# EAGLE schematic Hera v1 (EAGLE 7.4.0)
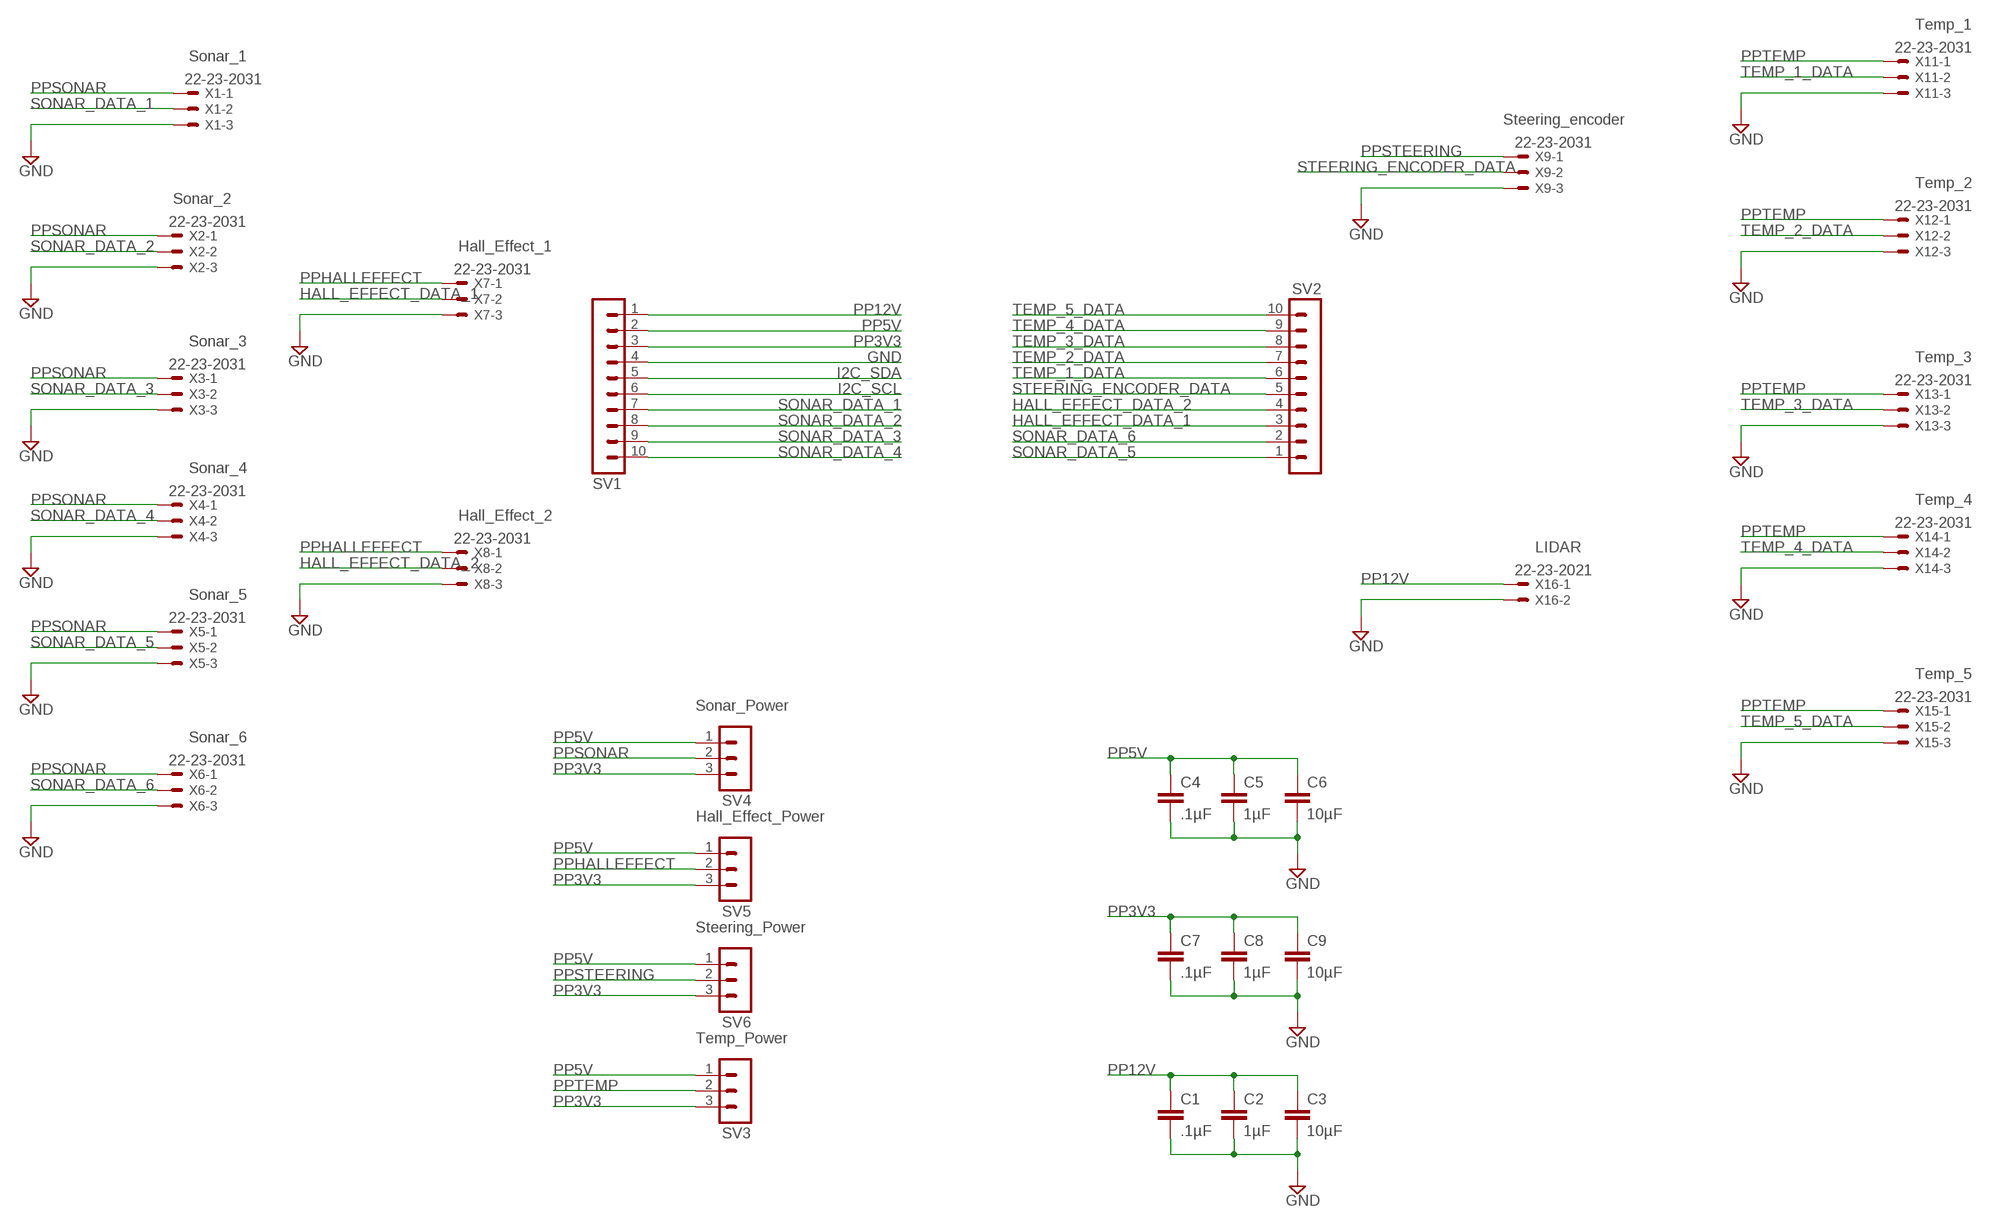
[diagram p0: schematic, sheet 1]

## Parts
C1  .1µF  C-EUC0402  [C0402]
C2  1µF  C-EUC0603  [C0603]
C3  10µF  C-EUC1206  [C1206]
C4  .1µF  C-EUC0402  [C0402]
C5  1µF  C-EUC0603  [C0603]
C6  10µF  C-EUC1206  [C1206]
C7  .1µF  C-EUC0402  [C0402]
C8  1µF  C-EUC0603  [C0603]
C9  10µF  C-EUC1206  [C1206]
SV1  MA10-1  [MA10-1]
SV2  MA10-1  [MA10-1]
SV3  MA03-1  [MA03-1]
SV4  MA03-1  [MA03-1]
SV5  MA03-1  [MA03-1]
SV6  MA03-1  [MA03-1]
X1  22-23-2031  [22-23-2031]
X2  22-23-2031  [22-23-2031]
X3  22-23-2031  [22-23-2031]
X4  22-23-2031  [22-23-2031]
X5  22-23-2031  [22-23-2031]
X6  22-23-2031  [22-23-2031]
X7  22-23-2031  [22-23-2031]
X8  22-23-2031  [22-23-2031]
X9  22-23-2031  [22-23-2031]
X11  22-23-2031  [22-23-2031]
X12  22-23-2031  [22-23-2031]
X13  22-23-2031  [22-23-2031]
X14  22-23-2031  [22-23-2031]
X15  22-23-2031  [22-23-2031]
X16  22-23-2021  [22-23-2021]

## Nets
GND: C1.2 C2.2 C3.2 C4.2 C5.2 C6.2 C7.2 C8.2 C9.2 SV1.4 X1.3 X2.3 X3.3 X4.3 X5.3 X6.3 X7.3 X8.3 X9.3 X11.3 X12.3 X13.3 X14.3 X15.3 X16.2
HALL_EFFECT_DATA_1: SV2.3 X7.2
HALL_EFFECT_DATA_2: SV2.4 X8.2
I2C_SCL: SV1.6
I2C_SDA: SV1.5
PP3V3: C7.1 C8.1 C9.1 SV1.3 SV3.3 SV4.3 SV5.3 SV6.3
PP5V: C4.1 C5.1 C6.1 SV1.2 SV3.1 SV4.1 SV5.1 SV6.1
PP12V: C1.1 C2.1 C3.1 SV1.1 X16.1
PPHALLEFFECT: SV5.2 X7.1 X8.1
PPSONAR: SV4.2 X1.1 X2.1 X3.1 X4.1 X5.1 X6.1
PPSTEERING: SV6.2 X9.1
PPTEMP: SV3.2 X11.1 X12.1 X13.1 X14.1 X15.1
SONAR_DATA_1: SV1.7 X1.2
SONAR_DATA_2: SV1.8 X2.2
SONAR_DATA_3: SV1.9 X3.2
SONAR_DATA_4: SV1.10 X4.2
SONAR_DATA_5: SV2.1 X5.2
SONAR_DATA_6: SV2.2 X6.2
STEERING_ENCODER_DATA: SV2.5 X9.2
TEMP_1_DATA: SV2.6 X11.2
TEMP_2_DATA: SV2.7 X12.2
TEMP_3_DATA: SV2.8 X13.2
TEMP_4_DATA: SV2.9 X14.2
TEMP_5_DATA: SV2.10 X15.2

## Notes on the sheet
- Temp_1
- Sonar_1
- Steering_encoder
- Temp_2
- Sonar_2
- Hall_Effect_1
- Sonar_3
- Temp_3
- Sonar_4
- Temp_4
- Hall_Effect_2
- LIDAR
- Sonar_5
- Temp_5
- Sonar_Power
- Sonar_6
- Hall_Effect_Power
- Steering_Power
- Temp_Power

## Library data of the parts
C1 C4 C7 = rcl:C-EU: CAPACITOR, European symbol; DIGI: 490-5920-1-ND
C2 C5 C8 = rcl:C-EU: CAPACITOR, European symbol; DIGI: 490-3897-1-ND
C3 C6 C9 = rcl:C-EU: CAPACITOR, European symbol; DIGI: 490-5525-1-ND
SV1 SV2 = con-lstb:MA10-1: PIN HEADER; OC_FARNELL: unknown; OC_NEWARK: unknown
SV3-SV6 = con-lstb:MA03-1: PIN HEADER; OC_FARNELL: unknown; OC_NEWARK: unknown
X1-X9 X11-X15 = con-molex:22-23-2031: .100" (2.54mm) Center Header - 3 Pin; MF: MOLEX; MPN: 22-23-2031; OC_FARNELL: 1462950; OC_NEWARK: 30C0862
X16 = con-molex:22-23-2021: .100" (2.54mm) Center Header - 2 Pin; MF: MOLEX; MPN: 22-23-2021; OC_FARNELL: 1462926; OC_NEWARK: 25C3832